# Altium schematic sheet CarrierBoard.SchDoc: Sanhaço - CarrierBoard
size A4; DocumentNumber: CB01; Revision: 1.1; SheetNumber: 1; SheetTotal: 4; ProjectName: CarrierBoard - Sanhaço
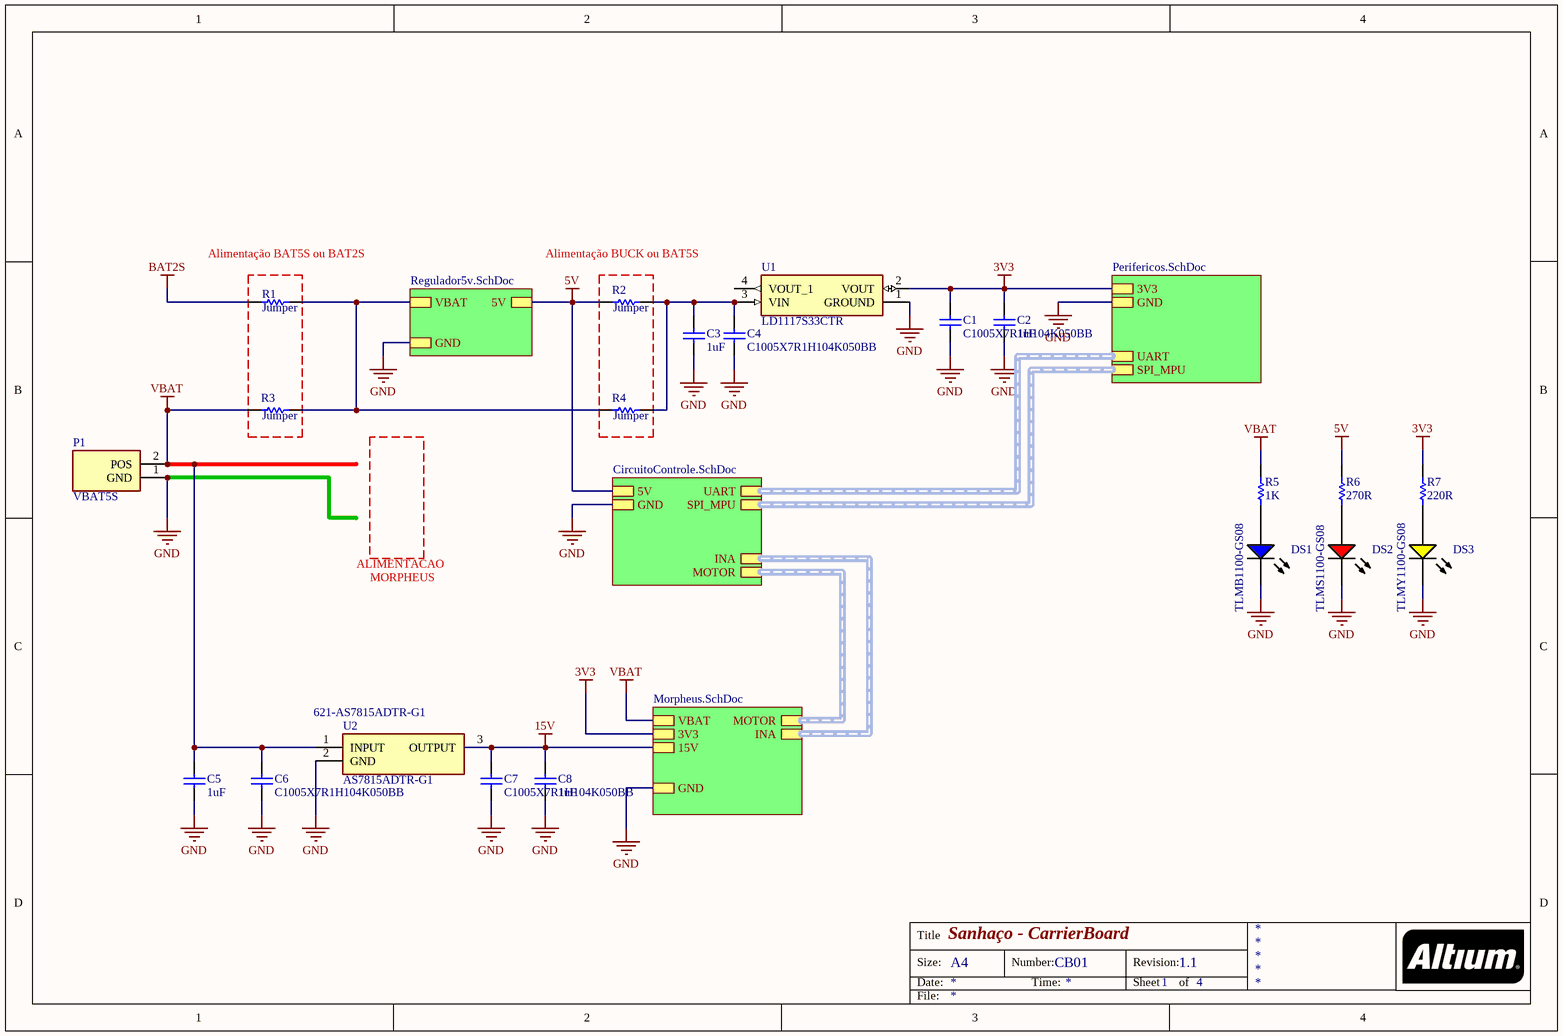
[diagram p0: CarrierBoard.SchDoc]

## Parts
C1  C1005X7R1H104K050BB  [TDK-C1005-2_M]
C2  1uF  [CAPC1608X90X35ML10T15]
C3  1uF  [CAPC1608X90X35ML10T15]
C4  C1005X7R1H104K050BB  [TDK-C1005-2_M]
C5  1uF  [CAPC1608X90X35ML10T15]
C6  C1005X7R1H104K050BB  [TDK-C1005-2_M]
C7  C1005X7R1H104K050BB  [TDK-C1005-2_M]
C8  1uF  [CAPC1608X90X35ML10T15]
DS1  TLMB1100-GS08  [VISH-TLMX1100-2_V]
DS2  TLMS1100-GS08  [VISH-TLMX1100_V]
DS3  TLMY1100-GS08  [VISH-TLMX1100-2_V]
P1  VBAT5S  [SHDR2W320P716_1X2_1574X813X1588P]
R1  Jumper  [RESC0402(1005)_N]
R2  Jumper  [RESC0402(1005)_N]
R3  Jumper  [RESC0402(1005)_N]
R4  Jumper  [RESC0402(1005)_N]
R5  1K  [RESC0805(2012)_N]
R6  270R  [RESC0402(1005)_N]
R7  220R  [RESC1608X55X25NL10T15]
U1  LD1117S33CTR  [SOT230P700X190-4N]
U2  AS7815ADTR-G1  Supplier Part Number 1: 621-AS7815ADTR-G1  [ZLDO1117K50TC]

## Sub-sheets
Designator = Regulador5v.SchDoc: VBAT, 5V, GND
Designator = Perifericos.SchDoc: 3V3, GND, SPI_MPU (harness SPI_MPU), UART (harness UART)
Designator = CircuitoControle.SchDoc: 5V, GND, UART (harness UART), SPI_MPU (harness SPI_MPU), MOTOR (harness MOTOR), INA (harness INA)
Designator = Morpheus.SchDoc: 15V, GND, INA (harness INA), MOTOR (harness MOTOR), VBAT, 3V3

## Nets
3V3: C1.2 C2.2 R7.2 U1.2(VOUT) ; sheet Designator/3V3, sheet Designator/3V3
5V: R2.1 R6.2 ; sheet Designator/5V, sheet Designator/5V
15V: C7.2 C8.2 U2.3(OUTPUT) ; sheet Designator/15V
BAT2S: R1.1
GND: C1.1 C2.1 C3.1 C4.1 C5.1 C6.1 C7.1 C8.1 DS1.2(K) DS2.2(K) DS3.2(K) P1.1(GND) U1.1(GROUND) U2.2(GND) ; sheet Designator/GND, sheet Designator/GND, sheet Designator/GND, sheet Designator/GND
VBAT: C5.2 C6.2 P1.2(POS) R3.1 R5.2 U2.1(INPUT) ; sheet Designator/VBAT
NetC3_2: C3.2 C4.2 R2.2 R4.2 U1.3(VIN)
NetDS1_1: DS1.1(A) R5.1
NetDS2_1: DS2.1(A) R6.1
NetDS3_1: DS3.1(A) R7.1
NetR1_2: R1.2 R3.2 R4.1 ; sheet Designator/VBAT

Not connected (* = marked no-connect by the designer): U1 4(VOUT_1)

## Notes on the sheet
- (near R1) Alimentação BAT5S ou BAT2S
- (near R2) Alimentação BUCK ou BAT5S
- ALIMENTACAO
- MORPHEUS
- Title
- Size:
- Date:
- A4
- Number:
- Time:
- Revision:
- Sheet
- of
- File:

## Library data of the parts
C1 C4 C6 C7 = CMP-2000-05393-1: Chip Capacitor, 0.1 uF, +/- 10%, 50 V, -55 to 125 degC, 0402(1005 Metric), RoHS, Tape and Reel; PCN Part Number: MLCCPartNumberChange30/Nov/2012; Manufacturer: TDK; Product Training Modules: CSeriesGeneralApplicationsSEAT,CCV,andTVCLDesignToolsGuidetoReplacinganElectrolyticCapacitorwithanMLCC; Other Names: 445-5932-1; Kits: 445-9021-KIT-ND-KITMLCC100PF-10UF04026.3-50V445-9003-KIT-ND-KITCAPCERHICAPMLCCSMD; Voltage - Rated: 50V; Temperature Coefficient: X7R; Capacitance: 0.1µF; Online Catalog: CSeries,GeneralPurpose; Manufacturer URL: http://www.tdk.com/; Category: Capacitors; Mounting Type: SurfaceMount,MLCC; Datasheet Version: Mar-15; Datasheet URL: http://www.farnell.com/datasheets/1913358.pdf; Packaging: CutTape(CT); Standard Package: 1; Features: -; Operating Temperature: -55degC~125degC; Tolerance: ±10%; RoHS Information: RoHSCertificate-MLCC; Applications: GeneralPurpose; Lead Style: -; Ratings: -; Height - Seated (Max): -; Lead Spacing: -; Package / Case: 0402(1005Metric); Series: C; Family: CeramicCapacitors
C2 C3 C5 C8 = CMP-2006-02823-1: MURATA   GRM188R61H105KAALD   Multilayer Ceramic Capacitor, GRM Series, 1 F,  10%, X5R, 50 V, 0603 [1608 Metric]; Dielectric: X7R; Voltage Rating: 50V; Manufacturer: Murata; Part Number: GRM188R61H105KAALD; Supplier 1: Mouser; Supplier Part Number 1: 81-GRM188R61H105KALD; Manufacturer Part Number: GRM188R61H105KAALD; Stock 1: 0; Mount: Surface Mount; Case/Package: 0603; Weight: 0.000222oz; Case Code (Metric): 1608; Case Code (Imperial): 0603; Material: Ceramic; Min Operating Temperature: -55°C; Max Operating Temperature: 85°C; Capacitance: 1uF; Tolerance: 10%; Packaging: Tape and Reel; Voltage: 50V; Termination: SMD/SMT; Composition: Ceramic; Voltage Rating (DC): 50V; Package Quantity: 4000; Length: 1.6mm; Height: 0.8mm; Width: 0.8mm; Thickness: 0.035inch; Depth: 0.8mm; Radiation Hardening: No; REACH SVHC: No SVHC; Lead Free: Lead Free; ComponentLink1URL: http://www.farnell.com/datasheets/2048611.pdf?src-supplier=Newark; ComponentLink1Description: http://www.farnell.com/datasheets/2048611.pdf?src-supplier=Newark; ComponentLink2URL: http://www.farnell.com/datasheets/1747450.pdf?src-supplier=Element14; ComponentLink2Description: http://www.farnell.com/datasheets/1747450.pdf?src-supplier=Element14; ComponentLink3URL: https://www.distrelec.biz/Web/Downloads/_t/ds/murata_MLCC_eng_tds.pdf?mime=application%2Fpdf&src-supplier=Distrelec; ComponentLink3Description: https://www.distrelec.biz/Web/Downloads/_t/ds/murata_MLCC_eng_tds.pdf?mime=application%2Fpdf&src-supplier=Distrelec; Datasheet: https://br.mouser.com/datasheet/2/281/murata_03052018_GRM_Series_1-1310166.pdf
DS1 = CMP-1666-00028-1: Blue LED, 10 mA, 3.9 V, -40 to 100 degC, 2-Pin SMD (0603), RoHS, Tape and Reel                  TLMB1100-GS08; Tolerance: 10%; Voltage Rating: 100 V; Capacitance: 10 nF; Type (Capacitors): X7R; Case\Package: Radial; ComponentLink1Description: Manufacturer URL; REACH SVHC: No SVHC; Package Quantity: 500; PackageDescription: 2-Pin Surface Mount Device, Body 1.6 x 0.8 mm; Pins: 2; ComponentLink2URL: http://download.siliconexpert.com/pdfs/2016/8/7/12/43/26/667/vsh_/manual/379263299541529tlmb1100.pdf; RoHSCompliant: true; Lead Pitch: 2.54 mm; Height: 2.54 mm; DatasheetVersion: Rev. 2.7, 03/2016; Length: 5.33 mm; ComponentLink1URL: http://www.vishay.com/; Min Operating Temperature: -55 degC; PackageReference: 0603; Packaging: Bulk; ComponentLink2Description: Datasheet; Max Operating Temperature: 125 degC; Radiation Hardening: No; Width: 3.81 mm; Mount: Through Hole
DS2 = CMP-1666-00027-1: LED, RED, 2.1 V, -40 to 100 degC, 2-Pin SMD (0603), RoHS, Tape and Reel; Type (Capacitors): C0G; Resistance: 100000000000 Ohm; Capacitance: 12 pF; Voltage Rating: 50 V; Tolerance: 5%; Min Operating Temperature: -55degC; REACH SVHC: No SVHC; ComponentLink2Description: Datasheet; ComponentLink1URL: http://www.vishay.com/; Width: 0.8 mm; Package Quantity: 4000; PackageReference: TLMX1100; ComponentLink2URL: http://www.vishay.com/docs/83173/tlmb1100.pdf; Case/Package: 0603; Case Code (Metric): 1608; Packaging: Tape and Reel; Pins: 2; ComponentLink1Description: Manufacturer URL; Max Operating Temperature: 125degC; Height: 0.8 mm; Length: 1.6 mm; Mount: Surface Mount; PackageDescription: 2-Pin Surface Mount Device, Body 1.6 x 0.8 mm; DatasheetVersion: Rev. 2.7, 03/2016; Case Code (Imperial): 0603; Voltage Rating (DC): 50 V; RoHSCompliant: True; Radiation Hardening: No
DS3 = CMP-1666-00030-1: Yellow LED, 20 mA, 2.1 V, -40 to 100 degC, 2-Pin SMD (0603), RoHS, Tape and Reel             TLMY1100-GS08; ComponentLink2Description: Datasheet; ComponentLink2URL: http://download.siliconexpert.com/pdfs/2016/8/7/12/43/26/667/vsh_/manual/379263299541529tlmb1100.pdf; ComponentLink1Description: Manufacturer URL; PackageDescription: 2-Pin Surface Mount Device, Body 1.6 x 0.8 mm; DatasheetVersion: Rev. 2.7, 03/2016; ComponentLink1URL: http://www.vishay.com/; PackageReference: 0603
P1 = PRT-10474: Connector; Manufacturer_Name: SparkFun; Datasheet Link: http://cdn.sparkfun.com/datasheets/Prototyping/xt60.pdf; Height: 15.875mm; Manufacturer_Part_Number: PRT-10474; Mouser Part Number: 474-PRT-10474; Mouser Price/Stock: https://www.mouser.com/Search/Refine.aspx?Keyword=474-PRT-10474
R1-R4 = CMP-1011-00001-1: Jumper 0402 (1005 Metric); Manufacturer: Vishay; Manufacturer Part Number: CRCW04020000Z0ED; Tolerance: None; Case-Metric: 1005; Case-EIA: 0402; Value: 0.00 Ohm; Resistance: 0mR; Power Rating: 63mW; Voltage Rating: 50V; Temperature Coefficient: 100ppm/°C; Power: None; Technology: SMT; Supplier 1: Mouser; Supplier Part Number 1: 71-CRCW0402-0-E3; Stock 1: 1223713; Pricing 1: 1=0.1, 10=0.017, 50=0.017, 100=0.007, 1000=0.005, 10000=0.004 (USD); Mount: Surface Mount; Case/Package: 0402; Weight: 2.3E-05oz; Contact Plating: Tin; Case Code (Imperial): 0402; Case Code (Metric): 1005; Min Operating Temperature: -55°C; Max Operating Temperature: 155°C; Composition: Thick Film; Termination: SMD/SMT; Packaging: Tape and Reel; Package Quantity: 1; Number of Terminations: 2; Military Standard: Not; Max Power Dissipation: 63mW; Voltage Rating (DC): 50V; Features: Automotive AEC-Q200; Length: 1mm; Height: 0.35mm; Width: 0.5mm; Depth: 0.5mm; Radiation Hardening: No; Lead Free: Lead Free; REACH SVHC: Unknown; ComponentLink1URL: http://www.vishay.com/docs/20035/dcrcwe3.pdf?src-supplier=Avnet+Europe; ComponentLink1Description: http://www.vishay.com/docs/20035/dcrcwe3.pdf?src-supplier=Avnet+Europe; ComponentLink2URL: http://www.vishay.com/docs/20035/dcrcwe3.pdf?src-supplier=Avnet; ComponentLink2Description: http://www.vishay.com/docs/20035/dcrcwe3.pdf?src-supplier=Avnet; ComponentLink3URL: http://www.vishay.com/docs/20035/dcrcwe3.pdf?src-supplier=Digi-Key; ComponentLink3Description: http://www.vishay.com/docs/20035/dcrcwe3.pdf?src-supplier=Digi-Key; ComponentLink4URL: http://www.farnell.com/datasheets/2111203.pdf?src-supplier=Element14; ComponentLink4Description: http://www.farnell.com/datasheets/2111203.pdf?src-supplier=Element14; ComponentLink5URL: http://www.vishay.com/docs/20035/dcrcwe3.pdf?src-supplier=Allied+Electronics; ComponentLink5Description: http://www.vishay.com/docs/20035/dcrcwe3.pdf?src-supplier=Allied+Electronics; ComponentLink6URL: https://www.distrelec.biz/Web/Downloads/a_/en/flD-CRCW-e3_data_en.pdf?mime=application%2Fpdf&src-supplier=Distrelec; ComponentLink6Description: https://www.distrelec.biz/Web/Downloads/a_/en/flD-CRCW-e3_data_en.pdf?mime=application%2Fpdf&src-supplier=Distrelec
R5 = CMP-1013-00074-1: 1K 0.125W 5% 0805 (2012 Metric)  SMD; Manufacturer: Yageo; Manufacturer Part Number: RC0805JR-071KL; Case-EIA: 0805; Case-Metric: 2012; Value: 1000.00 Ohm; Resistance: 1kR; Temperature Coefficient: 100ppm/°C; Power Rating: 125mW; Voltage Rating: 150V; Technology: SMT; Power: 0.125 W; Tolerance: 5 %; Supplier 1: Mouser; Supplier Part Number 1: 603-RC0805JR-071KL; Stock 1: 1222072; Pricing 1: 1=0.11, 10=0.026, 50=0.026, 100=0.009, 1000=0.007, 10000=0.004 (USD); Case/Package: 0805; Contact Plating: Tin,Lead,Matte; Case Code (Imperial): 0805; Case Code (Metric): 2012; Min Operating Temperature: -55°C; Max Operating Temperature: 155°C; Composition: Thick Film; Packaging: Tape and Reel; Termination: SMD/SMT; Military Standard: Not; Length: 2mm; Depth: 1.25mm; Radiation Hardening: No; REACH SVHC: Unknown; Lead Free: Lead Free; ComponentLink1URL: http://www.farnell.com/datasheets/2167052.pdf?src-supplier=Verical; ComponentLink1Description: http://www.farnell.com/datasheets/2167052.pdf?src-supplier=Verical; ComponentLink2URL: http://www.farnell.com/datasheets/2167052.pdf?src-supplier=Mouser; ComponentLink2Description: http://www.farnell.com/datasheets/2167052.pdf?src-supplier=Mouser; ComponentLink3URL: http://www.farnell.com/datasheets/442941.pdf?src-supplier=Element14; ComponentLink3Description: http://www.farnell.com/datasheets/442941.pdf?src-supplier=Element14; ComponentLink4URL: http://www.farnell.com/datasheets/444164.pdf?src-supplier=Element14; ComponentLink4Description: http://www.farnell.com/datasheets/444164.pdf?src-supplier=Element14
R6 = CMP-1011-00060-1: 270R 0.063W 5% 0402 (1005 Metric)  SMD                             603-AC0402JR-07270RL; Manufacturer: Yageo; Case-Metric: 1005; Value: 270.00 Ohm; Case-EIA: 0402; Max Power Dissipation: 63mW; Temperature Coefficient: 100ppm/°C; Tolerance: 5 %; Technology: SMT; Power: 0.063 W; Supplier 1: Mouser; Supplier Part Number 1: 603-AC0402JR-07270RL; Manufacturer Part Number: AC0402JR-07270RL; Stock 1: 82259; Pricing 1: 1=0.1, 10=0.015, 50=0.015, 100=0.005, 1000=0.004, 10000=0.004 (USD); Case/Package: 0402; Case Code (Metric): 1005; Case Code (Imperial): 0402; Min Operating Temperature: -55°C; Max Operating Temperature: 155°C; Packaging: Tape and Reel; Resistance: 270R; Composition: Thick Film; Number of Terminations: 2; Features: Moisture Resistant,Automotive AEC-Q200; Length: 0.039inch; Height: 0.015inch; Width: 0.02inch
R7 = CMP-2000-04878-1: Res 0603 220 Ohm 5% 0.1W(1/10W) ±100ppm/C Sulfur Resistant Pad SMD Automotive T/R; Manufacturer: Yageo; Part Number: AF0603FR-07130RL; Manufacturer Part Number 1: AF0603JR-07220RL; Description: RES SMD 220 OHM 5% 1/10W 0603; Max Power Dissipation: 100mW; Temperature Coefficient: 100ppm/°C; Supplier 1: Mouser; Supplier Part Number 1: 603-AF0603JR-07220RL; Manufacturer 1: Yageo; Stock 1: 9358; Pricing 1: 1=0,12000, 10=0,02700, 50=0,02700, 100=0,00900, 1000=0,00800, 10000=0,00500 (USD); RoHS: Yes; Case/Package: 0603; Min Operating Temperature: -55°C; Max Operating Temperature: 155°C; Packaging: Tape and Reel; Resistance: 220R; Composition: Thick Film; Number of Terminations: 2; Tolerance: 5%; Features: Moisture Resistant; Length: 0.063inch; Height: 0.022inch; Width: 0.031inch; Lead Free: Lead Free; ComponentLink1URL: http://www.yageo.com/documents/recent/PYu-AF_51_RoHS_L_5.pdf?src-supplier=Digi-Key; ComponentLink1Description: http://www.yageo.com/documents/recent/PYu-AF_51_RoHS_L_5.pdf?src-supplier=Digi-Key
U1 = LD1117S33CTR: Integrated Circuit; Manufacturer_Name: STMicroelectronics; Allied_Number: 70390200; Datasheet Link: http://www.st.com/st-web-ui/static/active/en/resource/technical/document/datasheet/CD00000544.pdf; Height: 1.9mm; Manufacturer_Part_Number: LD1117S33CTR; Mouser Part Number: 511-LD1117S33C; Mouser Price/Stock: https://www.mouser.com/Search/Refine.aspx?Keyword=511-LD1117S33C; RS Part Number: 1657750; RS Price/Stock: http://uk.rs-online.com/web/p/products/1657750; Allied Price/Stock: http://www.alliedelec.com/stmicroelectronics-ld1117s33ctr/70390200/
U2 = AS7805ADTR-G1: Integrated Circuit; Manufacturer_Name: Diodes Inc.; Manufacturer: Diodes; Output Voltage: 15V; Output Current: 1A; Dropout Voltage: 2V; Number of Regulators: 1; Datasheet Link: https://www.diodes.com/assets/Datasheets/AS78XXA.pdf; Height: 2mm; Manufacturer_Part_Number: AS7805ADTR-G1; Mouser Part Number: 621-AS7805ADTR-G1; Mouser Price/Stock: https://www.mouser.com/Search/Refine.aspx?Keyword=621-AS7805ADTR-G1; Supplier 1: Mouser; Manufacturer Part Number: AS7815ADTR-G1; Stock 1: 1565; Pricing 1: 1=0.43, 10=0.354, 50=0.354, 100=0.216, 1000=0.167, 10000=0.142 (USD); Mount: Surface Mount; Case/Package: TO-252-3; Min Operating Temperature: -40°C; Max Operating Temperature: 125°C; Packaging: Tape and Reel